# EAGLE design topboard-v2.0 (EAGLE 9.5.1)
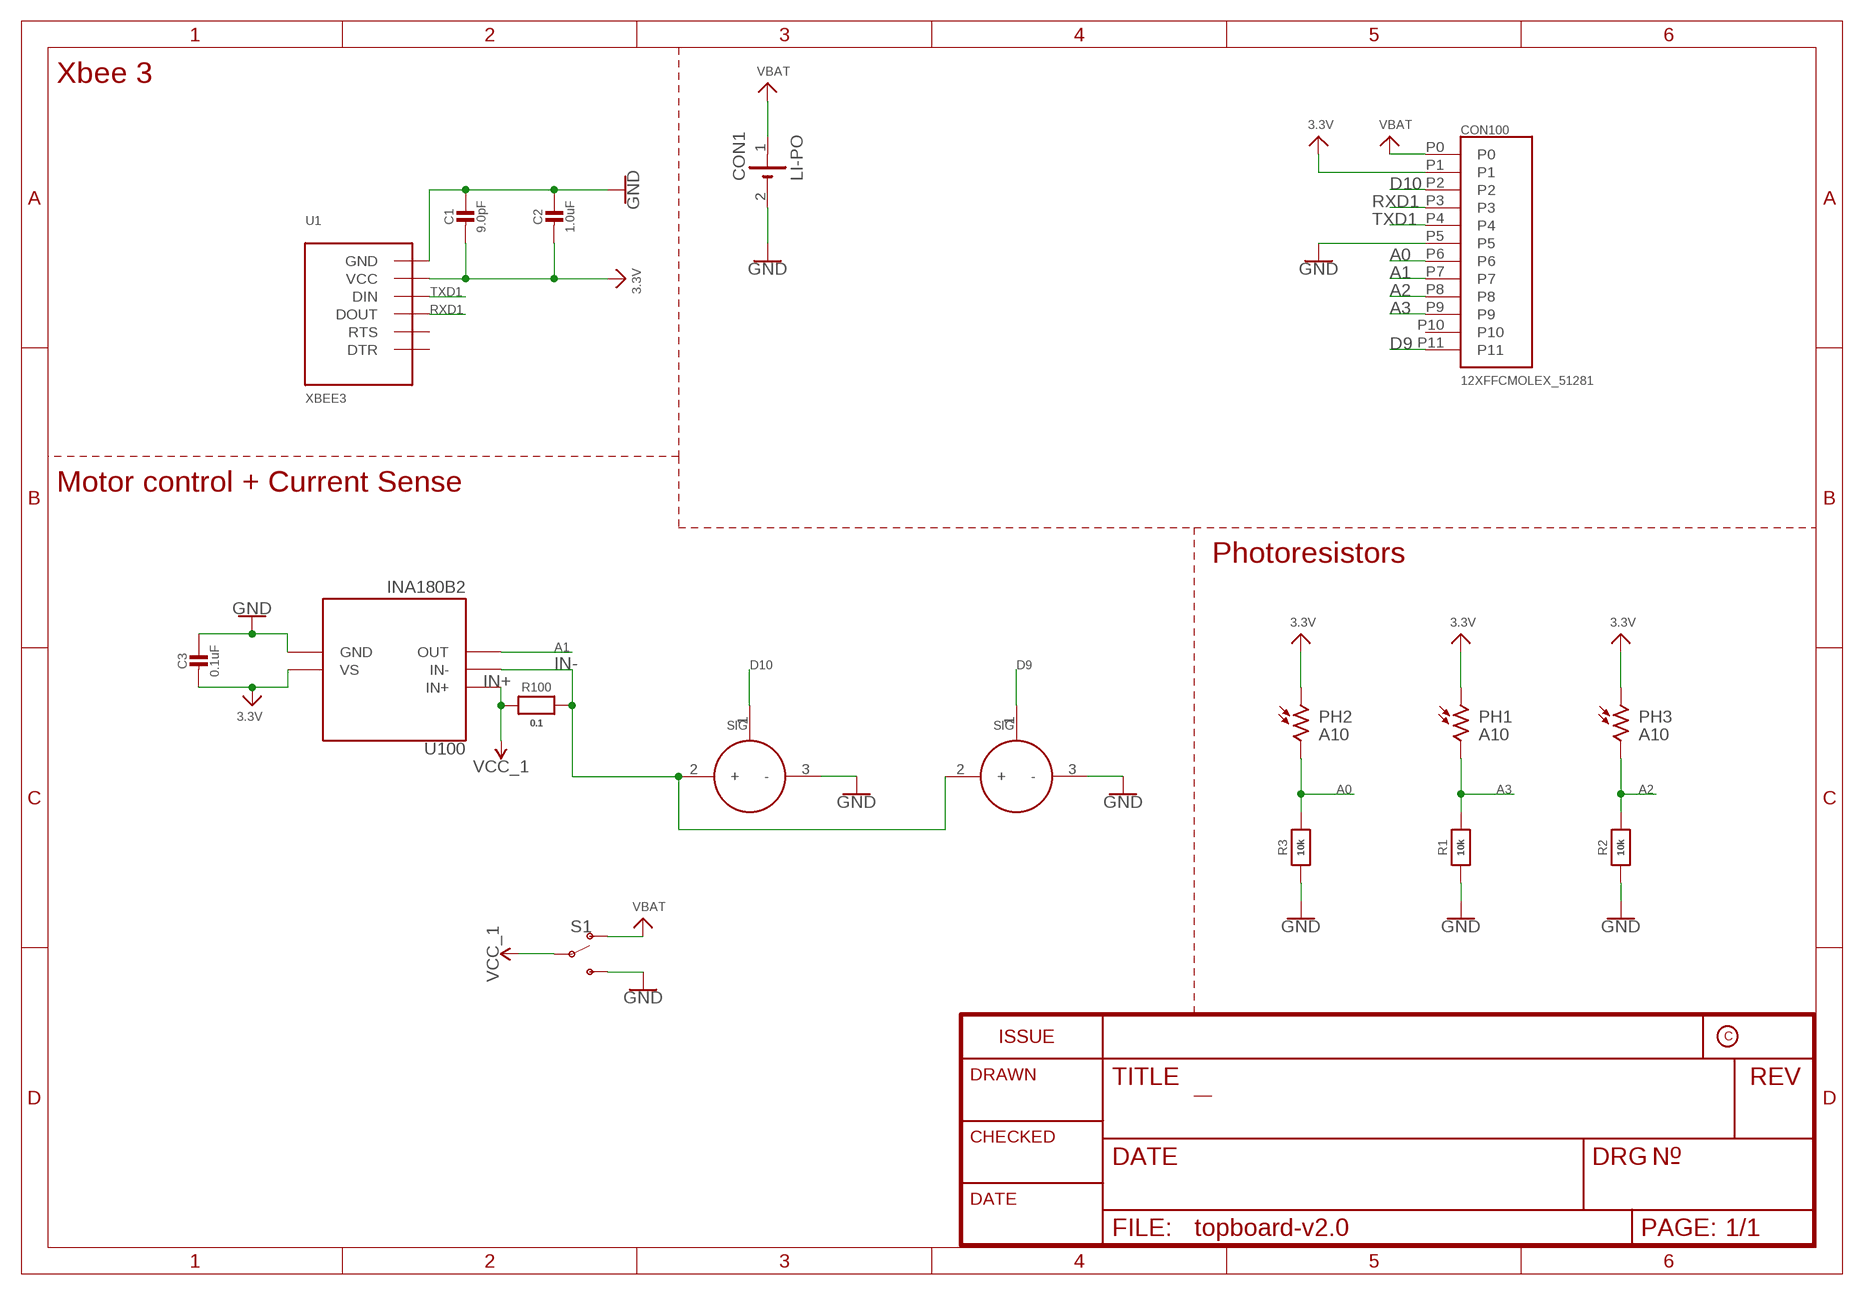
[diagram p0: schematic, sheet 1]

## Parts
C1  9.0pF  CAP_CERAMIC_0603MP  [_0603MP]
C2  1.0uF  CAP_CERAMIC_0603MP  [_0603MP]
C3  0.1uF  CAP_CERAMIC_0603MP  [_0603MP]
CON1  LI-PO  [1X02_BATT]
CON100  12XFFCMOLEX_51281  [MOLEX_51281-1294]
M1  SERVO  [1X03_SERVO]
M2  SERVO  [1X03_SERVO]
PH1  A10  [PHOTORESISTOR]
PH2  A10  [PHOTORESISTOR]
PH3  A10  [PHOTORESISTOR]
R1  10k  RESISTOR_0603MP  [_0603MP]
R2  10k  RESISTOR_0603MP  [_0603MP]
R3  10k  RESISTOR_0603MP  [_0603MP]
R100  0.1  RESISTOR_0603MP  [_0603MP]
S1  SWITCH-SPDT-SMD-RIGHT-ANGLE  [SWITCH_SPST_SMD_A]
U1  XBEE3  [XBEE3_MICRO]
U100  INA180B2  [SOT23-5]

## Nets
3.3V: C1.2 C2.2 C3.2 CON100.P1 PH1.1 PH2.1 PH3.1 U1.VCC U100.5(VS)
A0: CON100.P6 PH2.2 R3.2
A1: CON100.P7 U100.4(OUT)
A2: CON100.P8 PH3.2 R2.2
A3: CON100.P9 PH1.2 R1.2
D9: CON100.P11 M1.1(SIG)
D10: CON100.P2 M2.1(SIG)
GND: C1.1 C2.1 C3.1 CON1.2(-) CON100.P5 M1.3(-) M2.3(-) R1.1 R2.1 R3.1 S1.3(S) U1.GND1(GND) U1.GND2(GND) U1.GND3(GND) U1.GND4(GND) U1.GND5(GND) U1.GND6(GND) U100.2(GND)
IN+: R100.1 U100.1(IN+) ; supply symbol labelled VCC_1
IN-: M1.2(+) M2.2(+) R100.2 U100.3(IN-)
RXD1: CON100.P3 U1.DOUT/DIO13(DOUT)
TXD1: CON100.P4 U1.DIN/CONFIG/DIO14(DIN)
VBAT: CON1.1(+) CON100.P0 S1.1(O)
VCC_1: S1.2(P)
Unconnected: CON100.P10 U1.DTR/SLEEP_RQ/DIO8(DTR) U1.RTS/DIO6(RTS)

## Notes on the sheet
- Xbee 3
- Motor control + Current Sense
- Photoresistors

## Library data of the parts
C1-C3 = NU-Smarticle v2:CAP_CERAMIC: Ceramic Capacitors For new designs, use the packages preceded by an '_' character since they are more reliable: The following footprints should be used on most boards: _0402 - Standard footprint for regular board layouts _0603 - Standard footprint for regular board layouts _0805 - Standard footprint for regular board layouts _1206 - Standard footprint for regular board layouts For extremely tight-pitch boards where space is at a premium, the following 'micro-pitch' footprints can be used (smaller pads, no silkscreen outline, etc.): _0402MP - Micro-pitch footprint for very dense/compact boards _0603MP - Micro-pitch footprint for very dense/compact boards _0805MP - Micro-pitch footprint for very dense/compact boards _1206MP - Micro-pitch footprint for very dense/compact boards
CON1 = NU-Smarticle v2:LI-PO: Pins connecting to LiPo Battery
CON100 = NU-Smarticle v2:12XFFC
M1 M2 = NU-Smarticle v2:SERVO
PH1-PH3 = NU-Smarticle v2:A10: Sensor Robust Light Sensing Applications Outdoor Light Sensing Application Source: http://optoelectronics.perkinelmer.com/content/Datasheets/DTS_PhotocellsA1050.pdf
R1-R3 R100 = NU-Smarticle v2:RESISTOR: Resistors For new designs, use the packages preceded by an '_' character since they are more reliable: The following footprints should be used on most boards: _0402 - Standard footprint for regular board layouts _0603 - Standard footprint for regular board layouts _0805 - Standard footprint for regular board layouts _1206 - Standard footprint for regular board layouts For extremely tight-pitch boards where space is at a premium, the following 'micro-pitch' footprints can be used (smaller pads, no silkscreen outline, etc.): _0402MP - Micro-pitch footprint for very dense/compact boards _0603MP - Micro-pitch footprint for very dense/compact boards _0805MP - Micro-pitch footprint for very dense/compact boards _1206MP - Micro-pitch footprint for very dense/compact boards
S1 = CabelBot:SWITCH-SPDT: Single Pole, Double Throw (SPDT) Switch Single-pole, double-throw (SPDT) switch. Variant Overview SMD-AYZ0202 Surface Mount DPDT Switch <https://www.sparkfun.com/products/597> (COM-00597) Used on e.g. LilyPad Arduino USB - ATmega32U4 Board <https://www.sparkfun.com/products/12049> PTH-11.6X4.0MM SPDT Mini Power Switch <https://www.sparkfun.com/products/102> (COM-00102) Used on e.g. SparkFun Simon Says - Through-Hole Soldering Kit <https://www.sparkfun.com/products/10547> (KIT-10547) PTH-11.6X4.0MM-KIT KIT version of SPDT Mini Power Switch - Simplifies soldering by removing tStop of switch pins - only one side can be soldered. PTH-11.6X4.0MM-LOCK LOCK version of SPDT Mini Power Switch - Offset pins hold switch in place for easier soldering. SMD-RIGHT-ANGLE Surface Mount Right Angle Switch <https://www.sparkfun.com/products/10860> (COM-10860) Used on e.g. SparkFun ESP8266 Thing <https://www.sparkfun.com/products/13231>; PROD_ID: SWCH-10651; SF_SKU: COM-10860
U1 = NU-Smarticle v2:XBEE3: XBee 3 802.15
U100 = NU-Smarticle v2:INA180B2: 50x gain current sense amplifier

## Board
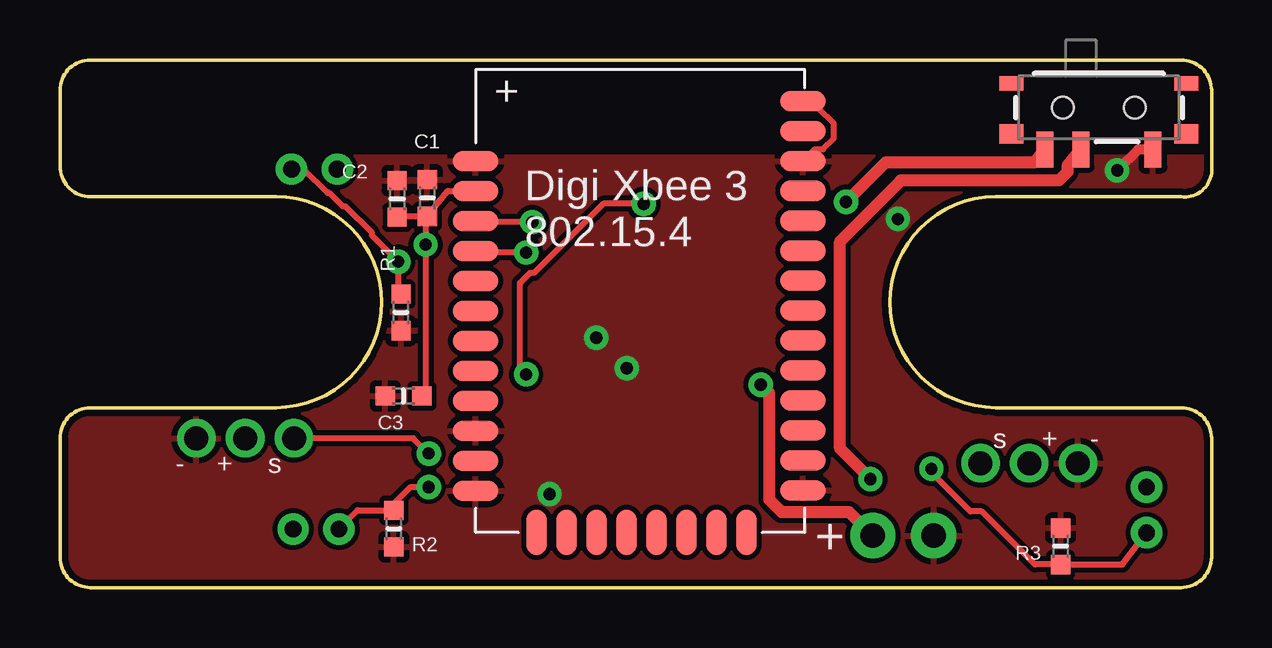
[diagram p1: board, top side]
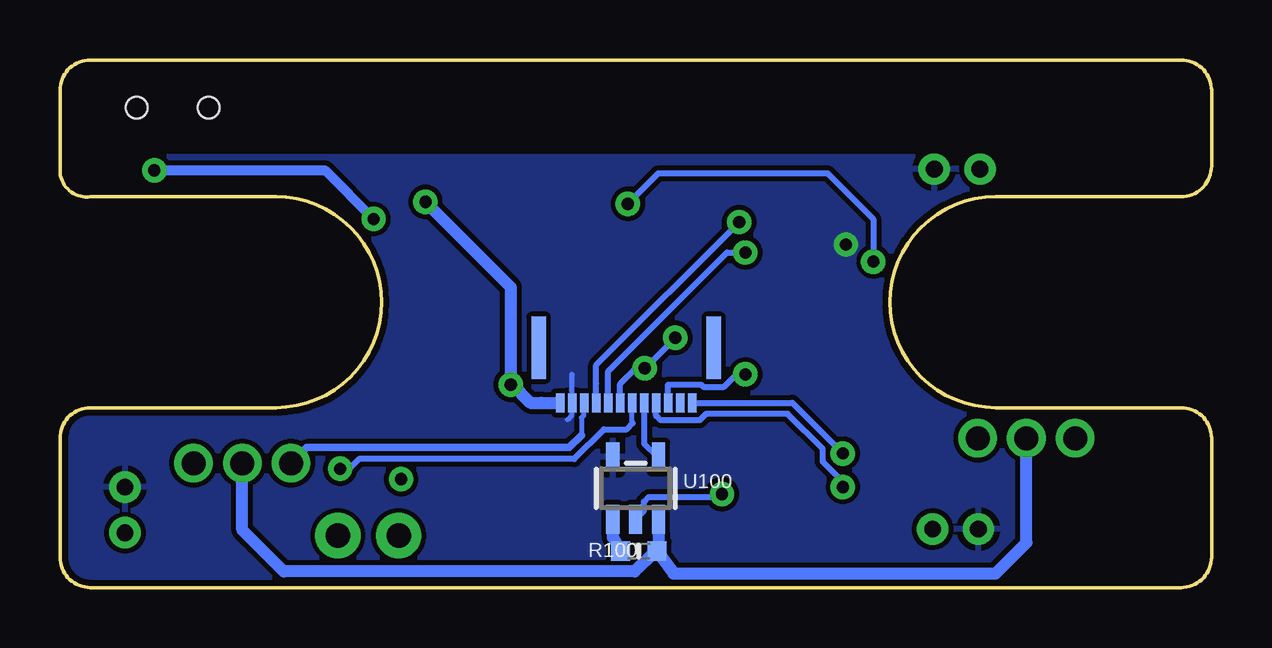
[diagram p2: board, bottom side, seen from below]

Size 48 x 22 mm. Coordinates in mm from the lower left corner, seen from the top.
Outline: 0,6.23 0,1.27 arc90 1.27,0 46.73,0 arc90 48,1.27 48,6.23 arc90 46.73,7.5 39,7.5 arc-180 39,16.3 46.73,16.3 arc90 48,17.27 48,20.73 arc90 46.73,22 1.27,22 arc90 0,20.73 0,17.57 arc90 1.27,16.3 9,16.3 arc-180 9,7.5 1.27,7.5 arc90 0,6.23
Copper layers (1*16): Top 0.035mm / dielectric 1.5mm / Bottom 0.035mm
Design rules "SparkFun": minimum track width 8mil, minimum drill 20mil, track to track 8mil, track to pad 8mil, pad to pad 8mil, via to via 8mil, smd to smd 8mil, copper to edge 10mil, drill to drill 8mil, minimum pad ring 12mil, minimum via ring 10mil, stop-mask expansion 4mil, vias tented up to drill 25mil, thermal gap 10mil

### Footprints (pad centres in the part's own frame; a part is rotated, then mirrored left to right if it is on the bottom)
_0603MP = smd 0.8 x 0.8: 1 -0.762,0; 2 0.762,0
1X02_BATT = drill 1.016 pad 1.88: 1 0,0; 2 2.54,0
MOLEX_51281-1294 = smd 0.35 x 0.8: P0 -2.75,-2.3; P1 -2.25,-2.3; P2 -1.75,-2.3; P3 -1.25,-2.3; P4 -0.75,-2.3; P5 -0.25,-2.3; P6 0.25,-2.3; P7 0.75,-2.3; P8 1.25,-2.3; P9 1.75,-2.3; P10 2.25,-2.3; P11 2.75,-2.3 | smd 0.6 x 2.6: P12 -3.65,0; P13 3.65,0
1X03_SERVO = drill 1: 1 0,0; 2 2.032,0; 3 4.064,0
PHOTORESISTOR = drill 0.7: 1 0,0; 2 1.905,0
SWITCH_SPST_SMD_A = smd 0.7 x 1.5: 1 -2.25,-1.75; 2 -0.75,-1.75; 3 2.25,-1.75 | smd 1 x 0.6: GND1 -3.65,1; GND3 3.65,1 | smd 1 x 0.8: GND2 -3.65,-1.1; GND4 3.65,-1.1 | hole 0.9: -1.5,0; 1.5,0
XBEE3_MICRO = smd 0.864 x 1.905: [RESERVED1] 0.681,-9.652; [RESERVED2] 1.93,-9.652; [RESERVED3] 3.18,-9.652; [RESERVED4] 4.43,-9.652; SPI_CLK/DIO18 -4.318,-9.652; SPI_MOSI/DIO15 -0.569,-9.652; SPI_MOSI/DIO16 -1.819,-9.652; SPI_SSEL/DIO17 -3.068,-9.652 | smd 1.905 x 0.864: [RESERVED5] 6.782,-6.65; AD0/DIO0 6.782,4.597; AD1/DIO1 6.782,3.348; AD2/DIO2 6.782,2.098; AD3/DIO3 6.782,0.848; ASSOCIATE/DIO5 6.782,-1.651; CTS/DIO7 6.782,-4.15; DIN/CONFIG/DIO14 -6.858,2.093; DIO4 6.782,-5.4; DIO12 -6.858,0.843; DOUT/DIO13 -6.858,3.343; DTR/SLEEP_RQ/DIO8 -6.858,-4.155; GND1 -6.858,5.842; GND2 -6.858,-5.405; GND3 -6.858,-7.904; GND4 6.782,-7.899; GND5 6.782,5.847; GND6 6.782,8.346; ON/SLEEP/DIO9 6.782,-2.901; PWM1/DIO11 -6.858,-2.906; RF 6.782,7.097; RSSI_PWM/DIO10 -6.858,-1.656; RST -6.858,-0.406; RTS/DIO6 6.782,-0.401; SPI_ATTN/BOOTMODE/DIO19 -6.858,-6.655; VCC -6.858,4.592
SOT23-5 = smd 0.55 x 1.2: 1 -0.95,-1.3; 2 0,-1.3; 3 0.95,-1.3; 4 0.95,1.3; 5 -0.95,1.3

### Placement (x,y rotation side)
C1  15.31,16.24 270 top
C2  14.06,16.2 270 top
C3  14.32,7.99 0 top
CON1  33.88,2.17 0 top
CON100  24.4,10 0 bottom
M1  9.75,6.23 180 top
M2  38.37,5.18 0 top
PH1  11.56,17.45 180 top
PH2  45.29,4.19 270 top
PH3  9.72,2.44 0 top
R1  14.21,11.47 90 top
R2  13.91,2.46 90 top
R3  41.71,1.72 270 top
R100  23.88,1.52 0 bottom
S1  43.31,20.02 0 top
U1  24.19,11.94 0 top
U100  24.01,4.14 0 bottom

### Tracks (layer width: path | path; a pad name or v marks a point on that pad's centre or on a via)
3.3V  (via drill 0.51)
  Top 0.254: C1.2 16.16,16.54 U1.VCC | C2.2 14.1,15.48 C1.2 | C1.2 15.24,15.41 v15.24,14.3 15.24,8.14 C3.2
  Bottom 0.203: CON100.P1 26.65,8.87 26.67,8.89 | 26.85,7 26.67,7.17 26.67,8.89 | 26.67,8.89
  pour Bottom: 48.01,17.97 0,17.97 0,-0.05 48.13,-0.05 47.88,6.05
A0  (via drill 0.51)
  Top 0.254: PH2.2 44.29,0.96 R3.2 40.64,0.96 38.42,3.17 37.95,3.17 36.32,4.8 v36.32,4.95
  Bottom 0.203: 24.13,6.86 24.15,6.88 CON100.P6
  Bottom 0.254: 24.13,6.86 24.38,6.6 25.33,6.6 26.57,5.36 35.53,5.36 35.94,4.95 v36.32,4.95
A1
  Bottom 0.254: U100.4 23.1,5.44 23.65,6 CON100.P7
A2  (via drill 0.51)
  Top 0.254: PH3.2 12.4,3.22 R2.2 13.91,3.49 14.62,4.19 v15.37,4.19
  Bottom 0.254: CON100.P8 23.15,7.15 23.14,7.15 22.96,6.97 21.34,6.97 21.07,7.24 17.67,7.24 16.2,5.78 16.2,5.24 15.37,4.4 v15.37,4.19
A3  (via drill 0.51)
  Top 0.254: R1.2 14.1,12.35 v14.1,13.59 13,14.69 13,14.79 11.9,15.89 11.8,15.89 11.79,15.9 11.22,16.46 11.15,16.46 10.16,17.45 PH1.2 | v19.43,8.89 19.18,9.14 19.18,12.7 19.61,13.13 19.78,13.13 22.65,16 v24.33,16
  Bottom 0.254: CON100.P9 22.65,8.46 21.28,8.46 21.19,8.37 20.31,8.37 19.79,8.89 v19.43,8.89 | v24.33,16 23.06,17.27 16,17.27 14.1,15.37 v14.1,13.59
D9  (via drill 0.51)
  Top 0.254: v15.37,5.59 14.73,6.23 M1.1
  Bottom 0.254: CON100.P11 17.48,7.7 v15.37,5.59
D10
  Bottom 0.203: CON100.P2 26.17,7.68 26.17,7.17 26.26,7.08 26.26,6.35
  Bottom 0.305: 26.26,6.35 26.77,5.84 37.71,5.84 M2.1
GND  (via drill 0.51)
  Top 0.254: U1.GND5 31.46,18.28 31.81,18.28 32.26,18.73 32.26,19.36 31.62,19.99 31.62,20.4 31.08,20.4 U1.GND6
  Top 0.406: S1.3 44.94,18.27 v44.07,17.4
  Bottom 0.254: U100.2 23.66,3.19 23.66,3.58 23.47,3.77 20.53,3.77 v20.41,3.9 | CON100.P5 24.65,8.5 24,9.14 v23.62,9.14 v22.35,10.41
  Bottom 0.406: v44.07,17.4 36.96,17.4 v34.92,15.37
  pour Top: 0,18 0,0 48,0 48,17.99 43,18
IN+
  Bottom 0.508: R100.1 24.96,2.09 U100.1
IN-
  Bottom 0.508: U100.3 23.06,1.84 R100.2 | R100.2 23.37,1.34 23.86,0.86 24.05,0.67 38.67,0.67 40.4,2.4 M2.2 | R100.2 22.43,0.59 9,0.59 7.72,1.87 M1.2
RXD1  (via drill 0.51)
  Top 0.254: v19.68,15.24 17.38,15.24 U1.DOUT/DIO13
  Bottom 0.254: CON100.P3 25.65,8.51 25.65,9.27 v19.68,15.24
TXD1  (via drill 0.51)
  Top 0.254: v19.43,13.97 17.4,13.97 U1.DIN/CONFIG/DIO14
  Bottom 0.254: CON100.P4 25.15,9.01 20.19,13.97 v19.43,13.97
VBAT  (via drill 0.51)
  Top 0.508: v29.21,8.46 29.56,8.11 29.56,3.68 30.08,3.16 32.89,3.16 CON1.1 | v32.77,16.08 34.42,17.73 40.65,17.73 S1.1
  Bottom 0.254: 27.28,7.7 CON100.P0
  Bottom 0.508: v32.77,16.08 29.21,12.53 v29.21,8.46 29.16,8.46 28.4,7.7 27.94,7.7 27.28,7.7
VCC_1  (via drill 0.51)
  Top 0.508: S1.2 41.99,17.57 41.99,17.33 41.63,16.97 35.05,16.97 32.51,14.43 32.51,5.79 v33.78,4.52